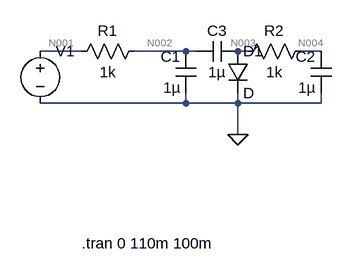
[diagram p0: schematic sinewave_using_lowpassfilter.asc]
sinewave_using_lowpassfilter.asc, the LTspice schematic file:
Version 4
SHEET 1 880 680
WIRE 32 -64 -32 -64
WIRE 192 -64 112 -64
WIRE 208 -64 192 -64
WIRE 288 -64 272 -64
WIRE 400 -64 368 -64
WIRE 192 16 192 0
WIRE 192 16 -32 16
WIRE 272 16 272 0
WIRE 272 16 192 16
WIRE 400 16 400 0
WIRE 400 16 272 16
WIRE 272 64 272 16
FLAG 272 64 0
SYMBOL cap 208 0 R180
WINDOW 0 24 56 Left 2
WINDOW 3 24 8 Left 2
SYMATTR InstName C1
SYMATTR Value 1µ
SYMBOL res 128 -80 R90
WINDOW 0 0 56 VBottom 2
WINDOW 3 32 56 VTop 2
SYMATTR InstName R1
SYMATTR Value 1k
SYMBOL res 384 -80 R90
WINDOW 0 0 56 VBottom 2
WINDOW 3 32 56 VTop 2
SYMATTR InstName R2
SYMATTR Value 1k
SYMBOL voltage -32 -80 R0
WINDOW 3 24 96 Invisible 2
WINDOW 123 0 0 Left 2
WINDOW 39 0 0 Left 2
SYMATTR Value PULSE(0 5 1n 1n 1n 0.5m 1m)
SYMATTR InstName V1
SYMBOL cap 416 0 R180
WINDOW 0 24 56 Left 2
WINDOW 3 24 8 Left 2
SYMATTR InstName C2
SYMATTR Value 1µ
SYMBOL cap 272 -80 R90
WINDOW 0 0 32 VBottom 2
WINDOW 3 32 32 VTop 2
SYMATTR InstName C3
SYMATTR Value 1µ
SYMBOL diode 256 -64 R0
SYMATTR InstName D1
TEXT 32 232 Left 2 !.tran 0 110m 100m

The netlist it stands for:
* sinewave_using_lowpassfilter.asc
C1 0 N002 1µ
R1 N002 N001 1k
R2 N004 N003 1k
V1 N001 0 PULSE(0 5 1n 1n 1n 0.5m 1m)
C2 0 N004 1µ
C3 N003 N002 1µ
D1 N003 0 D
.model D D
.lib standard.dio
.tran 0 110m 100m
.backanno
.end

* Results of the author's LTspice run, read from the files saved beside the schematic
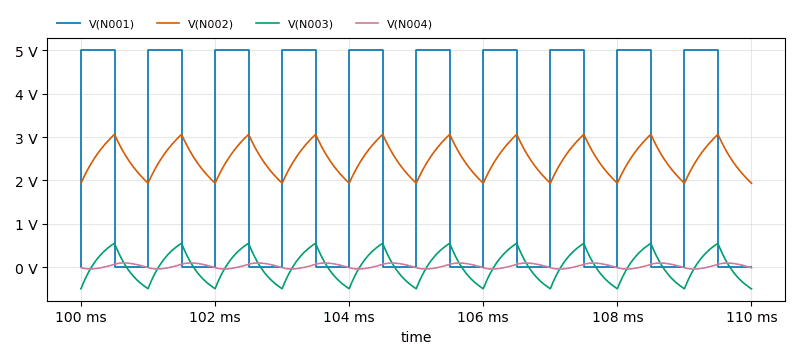
[diagram p1: Transient Analysis of sinewave_using_lowpassfilter.asc, plotted from the saved traces]
* Transient Analysis, 1 run:
*   V(N001): min 0 V, max 5 V, average 2.5 V, rms 3.536 V, last 0 V
*   V(N002): min 1.935 V, max 3.064 V, average 2.5 V, rms 2.522 V, last 1.936 V
*   V(N003): min -499 mV, max 551.6 mV, average 26.63 mV, rms 323.1 mV, last -499 mV
*   V(N004): min -43.27 mV, max 97.31 mV, average 26.97 mV, rms 56.09 mV, last -14.39 mV